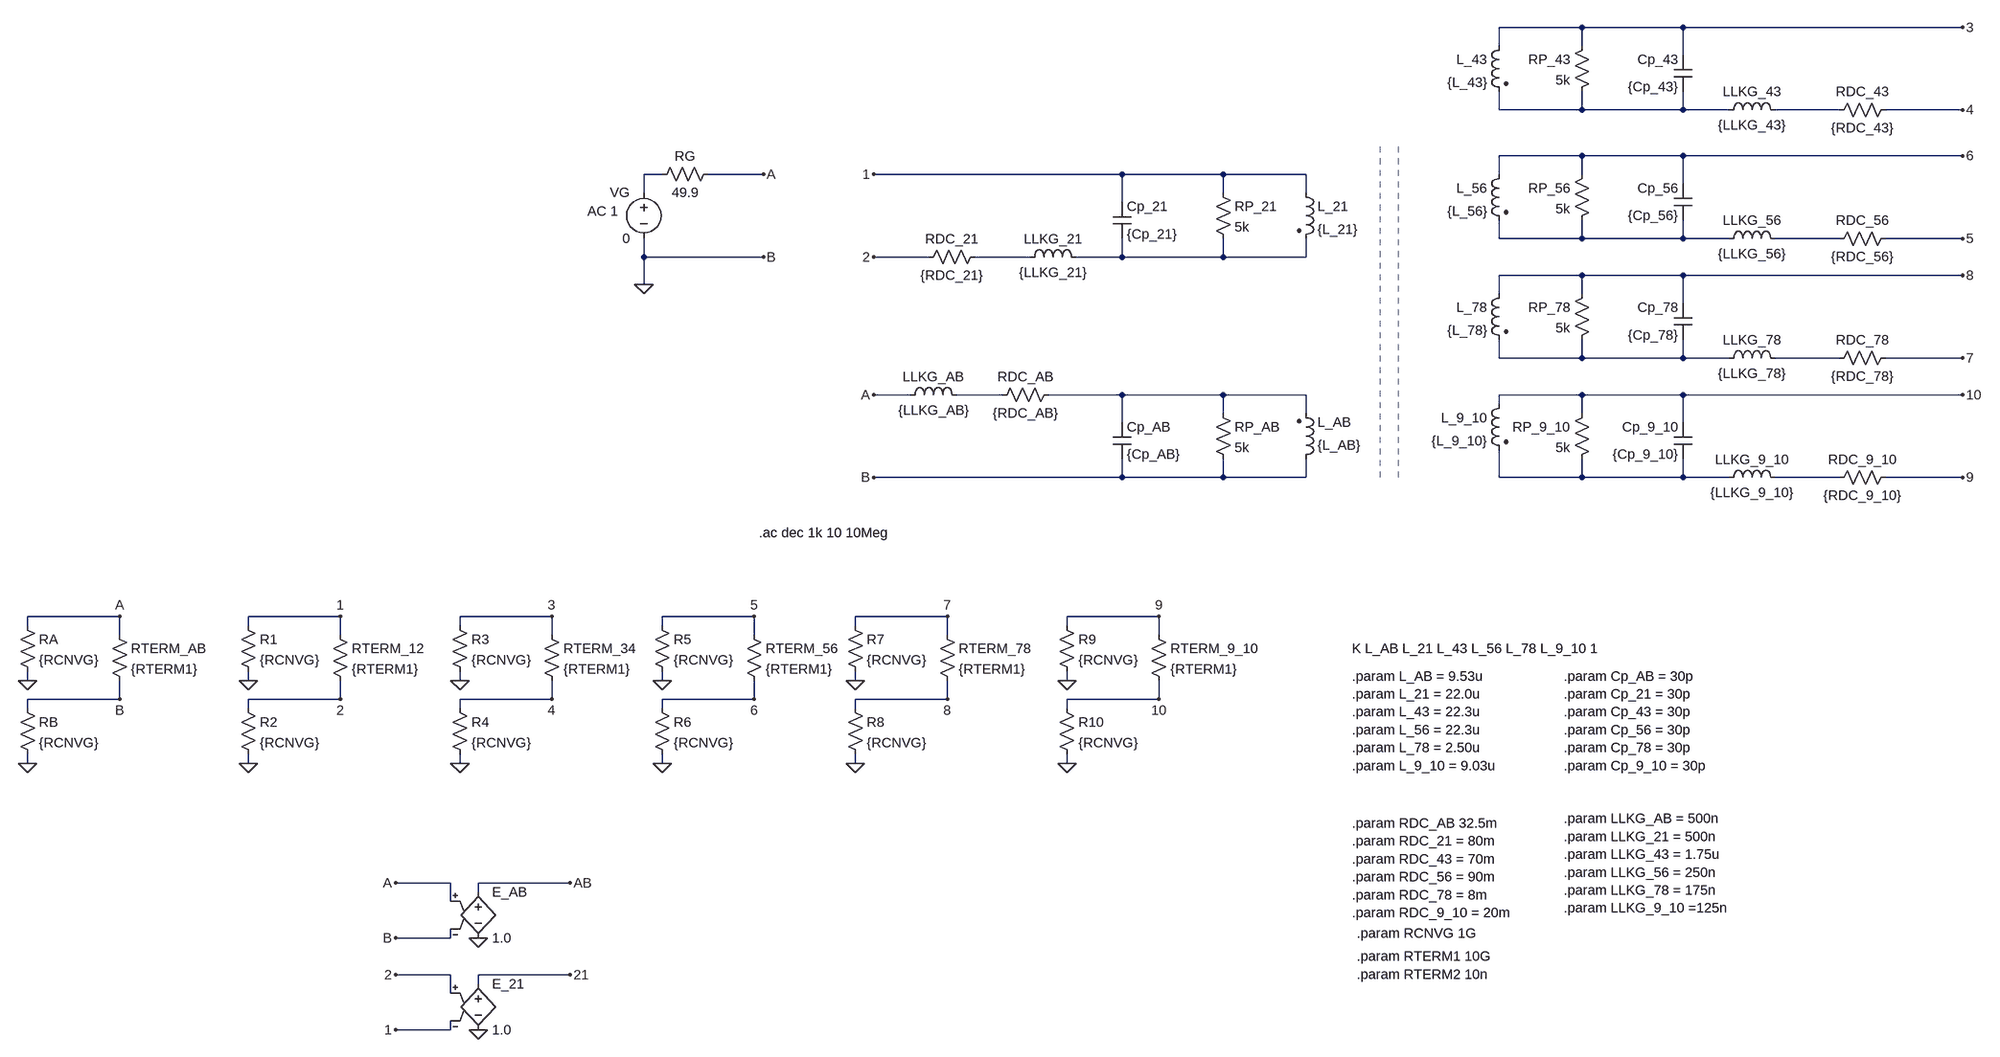
[diagram p0: schematic PCU_SU_Transformer_P518.asc]
PCU_SU_Transformer_P518.asc, the LTspice schematic file:
Version 4.1
SHEET 1 5945676 13421556
WIRE 3088 -736 2944 -736
WIRE 3264 -736 3088 -736
WIRE 3792 -736 3264 -736
WIRE 2944 -704 2944 -736
WIRE 3088 -704 3088 -736
WIRE 3264 -688 3264 -736
WIRE 2944 -592 2944 -624
WIRE 3088 -592 3088 -624
WIRE 3088 -592 2944 -592
WIRE 3264 -592 3264 -624
WIRE 3264 -592 3088 -592
WIRE 3344 -592 3264 -592
WIRE 3536 -592 3424 -592
WIRE 3792 -592 3616 -592
WIRE 3088 -512 2944 -512
WIRE 3264 -512 3088 -512
WIRE 3792 -512 3264 -512
WIRE 1488 -480 1456 -480
WIRE 1664 -480 1568 -480
WIRE 2288 -480 1856 -480
WIRE 2464 -480 2288 -480
WIRE 2608 -480 2464 -480
WIRE 2944 -480 2944 -512
WIRE 3088 -480 3088 -512
WIRE 3264 -464 3264 -512
WIRE 1456 -448 1456 -480
WIRE 2464 -448 2464 -480
WIRE 2608 -448 2608 -480
WIRE 2288 -432 2288 -480
WIRE 2944 -368 2944 -400
WIRE 3088 -368 3088 -400
WIRE 3088 -368 2944 -368
WIRE 3264 -368 3264 -400
WIRE 3264 -368 3088 -368
WIRE 3344 -368 3264 -368
WIRE 3536 -368 3424 -368
WIRE 3792 -368 3616 -368
WIRE 1456 -336 1456 -368
WIRE 1664 -336 1456 -336
WIRE 1952 -336 1856 -336
WIRE 2128 -336 2032 -336
WIRE 2288 -336 2288 -368
WIRE 2288 -336 2208 -336
WIRE 2464 -336 2464 -368
WIRE 2464 -336 2288 -336
WIRE 2608 -336 2608 -368
WIRE 2608 -336 2464 -336
WIRE 3088 -304 2944 -304
WIRE 3264 -304 3088 -304
WIRE 3792 -304 3264 -304
WIRE 1456 -288 1456 -336
WIRE 2944 -272 2944 -304
WIRE 3088 -272 3088 -304
WIRE 3264 -256 3264 -304
WIRE 2944 -160 2944 -192
WIRE 3088 -160 3088 -192
WIRE 3088 -160 2944 -160
WIRE 3264 -160 3264 -192
WIRE 3264 -160 3088 -160
WIRE 3344 -160 3264 -160
WIRE 3536 -160 3424 -160
WIRE 3792 -160 3616 -160
WIRE 1920 -96 1856 -96
WIRE 2080 -96 2000 -96
WIRE 2288 -96 2160 -96
WIRE 2464 -96 2288 -96
WIRE 2608 -96 2464 -96
WIRE 3088 -96 2944 -96
WIRE 3264 -96 3088 -96
WIRE 3792 -96 3264 -96
WIRE 2944 -80 2944 -96
WIRE 2464 -64 2464 -96
WIRE 2608 -64 2608 -96
WIRE 3088 -64 3088 -96
WIRE 2288 -48 2288 -96
WIRE 3264 -48 3264 -96
WIRE 2288 48 2288 16
WIRE 2288 48 1856 48
WIRE 2464 48 2464 16
WIRE 2464 48 2288 48
WIRE 2608 48 2608 16
WIRE 2608 48 2464 48
WIRE 2944 48 2944 0
WIRE 3088 48 3088 16
WIRE 3088 48 2944 48
WIRE 3264 48 3264 16
WIRE 3264 48 3088 48
WIRE 3344 48 3264 48
WIRE 3536 48 3424 48
WIRE 3792 48 3616 48
WIRE 544 320 384 320
WIRE 928 320 768 320
WIRE 1296 320 1136 320
WIRE 1648 320 1488 320
WIRE 1984 320 1824 320
WIRE 2352 320 2192 320
WIRE 384 336 384 320
WIRE 768 336 768 320
WIRE 1136 336 1136 320
WIRE 1488 336 1488 320
WIRE 1824 336 1824 320
WIRE 2192 336 2192 320
WIRE 544 352 544 320
WIRE 928 352 928 320
WIRE 1296 352 1296 320
WIRE 1648 352 1648 320
WIRE 1984 352 1984 320
WIRE 2352 352 2352 320
WIRE 384 432 384 416
WIRE 768 432 768 416
WIRE 1136 432 1136 416
WIRE 1488 432 1488 416
WIRE 1824 432 1824 416
WIRE 2192 432 2192 416
WIRE 544 464 544 432
WIRE 544 464 384 464
WIRE 928 464 928 432
WIRE 928 464 768 464
WIRE 1296 464 1296 432
WIRE 1296 464 1136 464
WIRE 1648 464 1648 432
WIRE 1648 464 1488 464
WIRE 1984 464 1984 432
WIRE 1984 464 1824 464
WIRE 2352 464 2352 432
WIRE 2352 464 2192 464
WIRE 384 480 384 464
WIRE 768 480 768 464
WIRE 1136 480 1136 464
WIRE 1488 480 1488 464
WIRE 1824 480 1824 464
WIRE 2192 480 2192 464
WIRE 384 576 384 560
WIRE 768 576 768 560
WIRE 1136 576 1136 560
WIRE 1488 576 1488 560
WIRE 1824 576 1824 560
WIRE 2192 576 2192 560
WIRE 1120 784 1024 784
WIRE 1328 784 1168 784
WIRE 1168 800 1168 784
WIRE 1120 816 1120 784
WIRE 1120 880 1120 864
WIRE 1120 880 1024 880
WIRE 1120 944 1024 944
WIRE 1328 944 1168 944
WIRE 1168 960 1168 944
WIRE 1120 976 1120 944
WIRE 1120 1040 1120 1024
WIRE 1120 1040 1024 1040
FLAG 1456 -288 0
FLAG 1856 -480 1
FLAG 1856 -336 2
FLAG 3792 -736 3
FLAG 3792 -592 4
FLAG 3792 -512 6
FLAG 3792 -368 5
FLAG 3792 -304 8
FLAG 3792 -160 7
FLAG 3792 -96 10
FLAG 3792 48 9
FLAG 1856 -96 A
FLAG 1856 48 B
FLAG 768 432 0
FLAG 928 320 1
FLAG 768 576 0
FLAG 928 464 2
FLAG 1136 432 0
FLAG 1296 320 3
FLAG 1136 576 0
FLAG 1296 464 4
FLAG 1488 432 0
FLAG 1648 320 5
FLAG 1488 576 0
FLAG 1648 464 6
FLAG 1824 432 0
FLAG 1984 320 7
FLAG 1824 576 0
FLAG 1984 464 8
FLAG 2192 432 0
FLAG 2352 320 9
FLAG 2192 576 0
FLAG 2352 464 10
FLAG 1168 880 0
FLAG 1024 784 A
FLAG 1024 880 B
FLAG 1328 784 AB
FLAG 1168 1040 0
FLAG 1024 944 2
FLAG 1024 1040 1
FLAG 1328 944 21
FLAG 1664 -480 A
FLAG 1664 -336 B
FLAG 384 432 0
FLAG 544 320 A
FLAG 384 576 0
FLAG 544 464 B
SYMBOL ind2 2592 -464 R0
SYMATTR InstName L_21
SYMATTR Value {L_21}
SYMBOL ind2 2960 -720 M0
SYMATTR InstName L_43
SYMATTR Value {L_43}
SYMBOL ind2 2592 32 M180
WINDOW 0 36 80 Left 2
WINDOW 3 36 40 Left 2
SYMATTR InstName L_AB
SYMATTR Value {L_AB}
SYMBOL ind2 2960 -496 M0
SYMATTR InstName L_56
SYMATTR Value {L_56}
SYMBOL ind2 2960 -288 M0
SYMATTR InstName L_78
SYMATTR Value {L_78}
SYMBOL ind2 2960 -96 M0
SYMATTR InstName L_9_10
SYMATTR Value {L_9_10}
SYMBOL res 2064 -80 R270
WINDOW 0 32 56 VTop 2
WINDOW 3 0 56 VBottom 2
SYMATTR InstName RDC_AB
SYMATTR Value {RDC_AB}
SYMBOL res 2048 -352 R90
WINDOW 0 0 56 VBottom 2
WINDOW 3 32 56 VTop 2
SYMATTR InstName RDC_21
SYMATTR Value {RDC_21}
SYMBOL res 3632 -608 R90
WINDOW 0 0 56 VBottom 2
WINDOW 3 32 56 VTop 2
SYMATTR InstName RDC_43
SYMATTR Value {RDC_43}
SYMBOL res 3632 -384 R90
WINDOW 0 0 56 VBottom 2
WINDOW 3 32 56 VTop 2
SYMATTR InstName RDC_56
SYMATTR Value {RDC_56}
SYMBOL res 3632 -176 R90
WINDOW 0 0 56 VBottom 2
WINDOW 3 32 56 VTop 2
SYMATTR InstName RDC_78
SYMATTR Value {RDC_78}
SYMBOL res 3632 32 R90
WINDOW 0 0 56 VBottom 2
WINDOW 3 32 56 VTop 2
SYMATTR InstName RDC_9_10
SYMATTR Value {RDC_9_10}
SYMBOL res 1584 -496 R90
WINDOW 0 0 56 VBottom 2
WINDOW 3 32 56 VTop 2
SYMATTR InstName RG
SYMATTR Value 49.9
SYMBOL voltage 1456 -464 M0
WINDOW 123 45 48 Left 2
WINDOW 39 0 0 Left 0
SYMATTR Value2 AC 1
SYMATTR InstName VG
SYMATTR Value 0
SYMBOL res 752 320 R0
SYMATTR InstName R1
SYMATTR Value {RCNVG}
SYMBOL res 752 464 R0
SYMATTR InstName R2
SYMATTR Value {RCNVG}
SYMBOL res 1120 320 R0
SYMATTR InstName R3
SYMATTR Value {RCNVG}
SYMBOL res 1120 464 R0
SYMATTR InstName R4
SYMATTR Value {RCNVG}
SYMBOL res 1472 320 R0
SYMATTR InstName R5
SYMATTR Value {RCNVG}
SYMBOL res 1472 464 R0
SYMATTR InstName R6
SYMATTR Value {RCNVG}
SYMBOL res 1808 320 R0
SYMATTR InstName R7
SYMATTR Value {RCNVG}
SYMBOL res 1808 464 R0
SYMATTR InstName R8
SYMATTR Value {RCNVG}
SYMBOL res 2176 320 R0
SYMATTR InstName R9
SYMATTR Value {RCNVG}
SYMBOL res 2176 464 R0
SYMATTR InstName R10
SYMATTR Value {RCNVG}
SYMBOL e 1168 784 R0
SYMATTR InstName E_AB
SYMATTR Value 1.0
SYMBOL e 1168 944 R0
SYMATTR InstName E_21
SYMATTR Value 1.0
SYMBOL ind 1904 -80 R270
WINDOW 0 32 56 VTop 2
WINDOW 3 5 56 VBottom 2
SYMATTR InstName LLKG_AB
SYMATTR Value {LLKG_AB}
SYMBOL cap 2272 -48 R0
SYMATTR InstName Cp_AB
SYMATTR Value {Cp_AB}
SYMBOL res 2448 -80 R0
SYMATTR InstName RP_AB
SYMATTR Value 5k
SYMBOL res 912 336 R0
SYMATTR InstName RTERM_12
SYMATTR Value {RTERM1}
SYMBOL res 1280 336 R0
SYMATTR InstName RTERM_34
SYMATTR Value {RTERM1}
SYMBOL res 1632 336 R0
SYMATTR InstName RTERM_56
SYMATTR Value {RTERM1}
SYMBOL res 1968 336 R0
SYMATTR InstName RTERM_78
SYMATTR Value {RTERM1}
SYMBOL res 2336 336 R0
SYMATTR InstName RTERM_9_10
SYMATTR Value {RTERM1}
SYMBOL ind 2112 -320 R270
WINDOW 0 32 56 VTop 2
WINDOW 3 5 56 VBottom 2
SYMATTR InstName LLKG_21
SYMATTR Value {LLKG_21}
SYMBOL cap 2272 -432 R0
SYMATTR InstName Cp_21
SYMATTR Value {Cp_21}
SYMBOL res 2448 -464 R0
SYMATTR InstName RP_21
SYMATTR Value 5k
SYMBOL res 368 320 R0
SYMATTR InstName RA
SYMATTR Value {RCNVG}
SYMBOL res 368 464 R0
SYMATTR InstName RB
SYMATTR Value {RCNVG}
SYMBOL res 528 336 R0
SYMATTR InstName RTERM_AB
SYMATTR Value {RTERM1}
SYMBOL ind 3440 -576 M270
WINDOW 0 32 56 VTop 2
WINDOW 3 5 56 VBottom 2
SYMATTR InstName LLKG_43
SYMATTR Value {LLKG_43}
SYMBOL cap 3280 -688 M0
SYMATTR InstName Cp_43
SYMATTR Value {Cp_43}
SYMBOL res 3104 -720 M0
SYMATTR InstName RP_43
SYMATTR Value 5k
SYMBOL ind 3440 -352 M270
WINDOW 0 32 56 VTop 2
WINDOW 3 5 56 VBottom 2
SYMATTR InstName LLKG_56
SYMATTR Value {LLKG_56}
SYMBOL cap 3280 -464 M0
SYMATTR InstName Cp_56
SYMATTR Value {Cp_56}
SYMBOL res 3104 -496 M0
SYMATTR InstName RP_56
SYMATTR Value 5k
SYMBOL ind 3440 -144 M270
WINDOW 0 32 56 VTop 2
WINDOW 3 5 56 VBottom 2
SYMATTR InstName LLKG_78
SYMATTR Value {LLKG_78}
SYMBOL cap 3280 -256 M0
SYMATTR InstName Cp_78
SYMATTR Value {Cp_78}
SYMBOL res 3104 -288 M0
SYMATTR InstName RP_78
SYMATTR Value 5k
SYMBOL ind 3440 64 M270
WINDOW 0 32 56 VTop 2
WINDOW 3 5 56 VBottom 2
SYMATTR InstName LLKG_9_10
SYMATTR Value {LLKG_9_10}
SYMBOL cap 3280 -48 M0
SYMATTR InstName Cp_9_10
SYMATTR Value {Cp_9_10}
SYMBOL res 3104 -80 M0
SYMATTR InstName RP_9_10
SYMATTR Value 5k
TEXT 2688 424 Left 2 !.param L_AB = 9.53u\n.param L_21 = 22.0u\n.param L_43 = 22.3u\n.param L_56 = 22.3u\n.param L_78 = 2.50u\n.param L_9_10 = 9.03u
TEXT 2688 680 Left 2 !.param RDC_AB 32.5m\n.param RDC_21 = 80m\n.param RDC_43 = 70m\n.param RDC_56 = 90m\n.param RDC_78 = 8m\n.param RDC_9_10 = 20m
TEXT 1656 144 Left 2 !.ac dec 1k 10 10Meg
TEXT 2696 872 Left 2 !.param RCNVG 1G
TEXT 3056 672 Left 2 !.param LLKG_AB = 500n\n.param LLKG_21 = 500n\n.param LLKG_43 = 1.75u\n.param LLKG_56 = 250n\n.param LLKG_78 = 175n\n.param LLKG_9_10 =125n
TEXT 3056 424 Left 2 !.param Cp_AB = 30p\n.param Cp_21 = 30p\n.param Cp_43 = 30p\n.param Cp_56 = 30p\n.param Cp_78 = 30p\n.param Cp_9_10 = 30p
TEXT 2688 376 Left 2 !K L_AB L_21 L_43 L_56 L_78 L_9_10 1
TEXT 2696 912 Left 2 !.param RTERM1 10G\n.param RTERM2 10n
LINE Normal 2736 -528 2736 48 2
LINE Normal 2768 -528 2768 48 2

The netlist it stands for:
* PCU_SU_Transformer_P518.asc
L_21 1 N007 {L_21}
L_43 3 N001 {L_43}
L_AB 0 N011 {L_AB}
L_56 6 N004 {L_56}
L_78 8 N008 {L_78}
L_9_10 10 N012 {L_9_10}
RDC_AB N010 N011 {RDC_AB}
RDC_21 N006 2 {RDC_21}
RDC_43 4 N002 {RDC_43}
RDC_56 5 N005 {RDC_56}
RDC_78 7 N009 {RDC_78}
RDC_9_10 9 N013 {RDC_9_10}
RG A N003 49.9
VG N003 0 0 AC 1
R1 1 0 {RCNVG}
R2 2 0 {RCNVG}
R3 3 0 {RCNVG}
R4 4 0 {RCNVG}
R5 5 0 {RCNVG}
R6 6 0 {RCNVG}
R7 7 0 {RCNVG}
R8 8 0 {RCNVG}
R9 9 0 {RCNVG}
R10 10 0 {RCNVG}
E_AB AB 0 A 0 1.0
E_21 21 0 2 1 1.0
LLKG_AB A N010 {LLKG_AB}
Cp_AB N011 0 {Cp_AB}
RP_AB N011 0 5k
RTERM_12 1 2 {RTERM1}
RTERM_34 3 4 {RTERM1}
RTERM_56 5 6 {RTERM1}
RTERM_78 7 8 {RTERM1}
RTERM_9_10 9 10 {RTERM1}
LLKG_21 N006 N007 {LLKG_21}
Cp_21 1 N007 {Cp_21}
RP_21 1 N007 5k
RA A 0 {RCNVG}
RB 0 0 {RCNVG}
RTERM_AB A 0 {RTERM1}
LLKG_43 N002 N001 {LLKG_43}
Cp_43 3 N001 {Cp_43}
RP_43 3 N001 5k
LLKG_56 N005 N004 {LLKG_56}
Cp_56 6 N004 {Cp_56}
RP_56 6 N004 5k
LLKG_78 N009 N008 {LLKG_78}
Cp_78 8 N008 {Cp_78}
RP_78 8 N008 5k
LLKG_9_10 N013 N012 {LLKG_9_10}
Cp_9_10 10 N012 {Cp_9_10}
RP_9_10 10 N012 5k
.param L_AB = 9.53u
.param L_21 = 22.0u
.param L_43 = 22.3u
.param L_56 = 22.3u
.param L_78 = 2.50u
.param L_9_10 = 9.03u
.param RDC_AB 32.5m
.param RDC_21 = 80m
.param RDC_43 = 70m
.param RDC_56 = 90m
.param RDC_78 = 8m
.param RDC_9_10 = 20m
.ac dec 1k 10 10Meg
.param RCNVG 1G
.param LLKG_AB = 500n
.param LLKG_21 = 500n
.param LLKG_43 = 1.75u
.param LLKG_56 = 250n
.param LLKG_78 = 175n
.param LLKG_9_10 =125n
.param Cp_AB = 30p
.param Cp_21 = 30p
.param Cp_43 = 30p
.param Cp_56 = 30p
.param Cp_78 = 30p
.param Cp_9_10 = 30p
K L_AB L_21 L_43 L_56 L_78 L_9_10 1
.param RTERM1 10G
.param RTERM2 10n
.backanno
.end